# Altium schematic sheet DAC and MIC.SchDoc
size A; DocumentNumber: 8; SheetNumber: 8; SheetTotal: 11
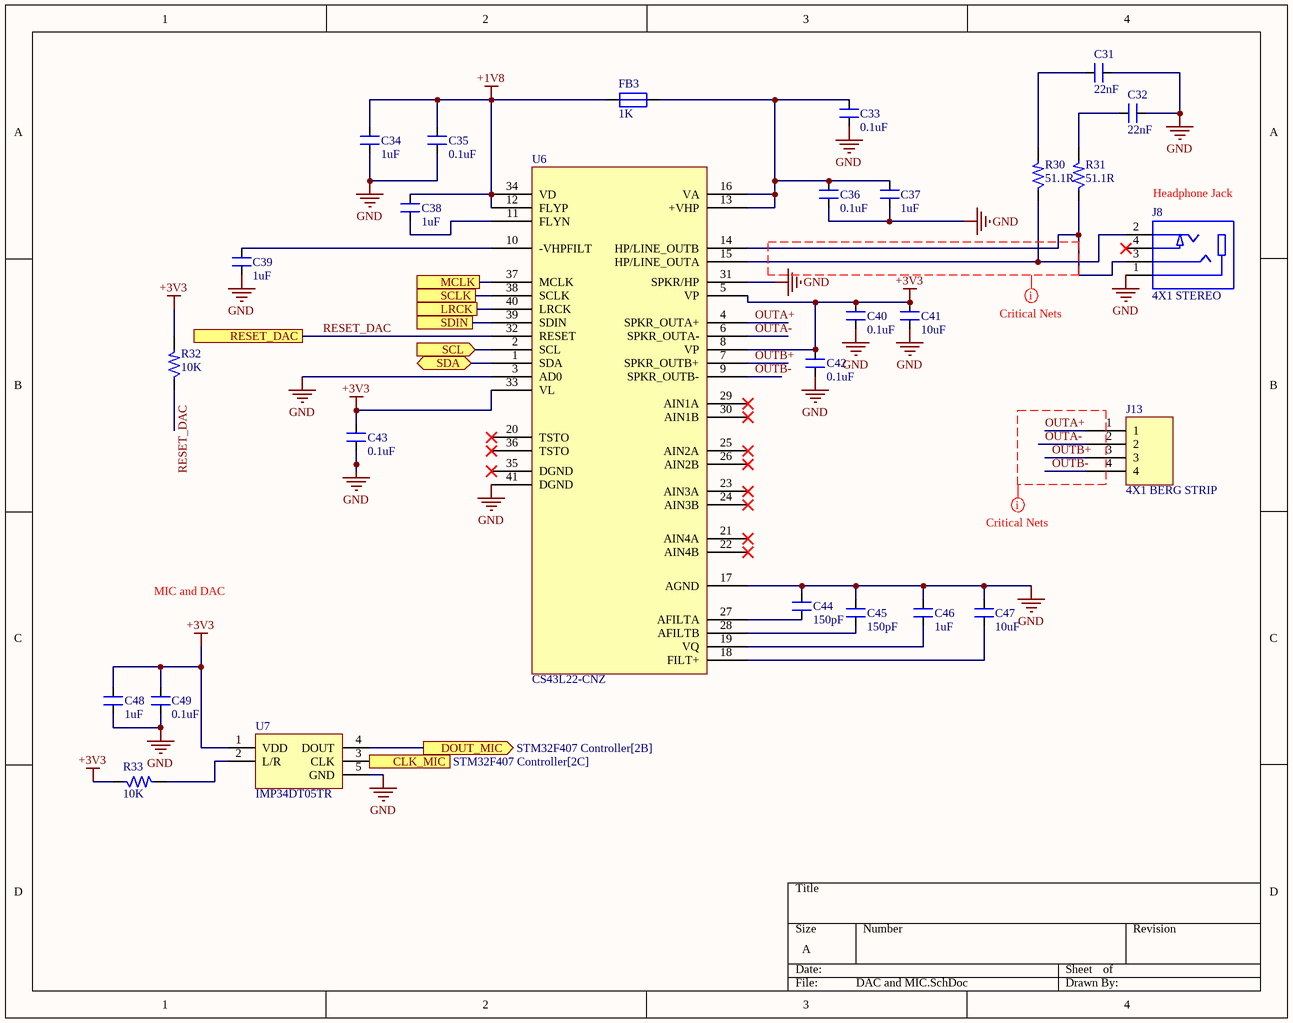
[diagram p0: DAC and MIC.SchDoc]

## Parts
C31  22nF  [CAP_0805]
C32  22nF  [CAP_0805]
C33  0.1uF  [CAP_0805]
C34  1uF  [CAP_0805]
C35  0.1uF  [CAP_0805]
C36  0.1uF  [CAP_0805]
C37  1uF  [CAP_0805]
C38  1uF  [CAP_0805]
C39  1uF  [CAP_0805]
C40  0.1uF  [CAP_0805]
C41  10uF  [CAP_1206]
C42  0.1uF  [CAP_0805]
C43  0.1uF  [CAP_0805]
C44  150pF  [CAP_0805]
C45  150pF  [CAP_0805]
C46  1uF  [CAP_0805]
C47  10uF  [CAP_1206]
C48  1uF  [CAP_0805]
C49  0.1uF  [CAP_0805]
FB3  1K  [IND_0805]
J8  4X1 STEREO  [CON_SJ-2504A-SMT-TR_SMD]
J13  4X1 BERG STRIP  [CON4_100_40D72_TH_ST_MALE]
R30  51.1R  [RES_0603]
R31  51.1R  [RES_0603]
R32  10K  [RES_0603]
R33  10K  [RES_0603]
U6  CS43L22-CNZ  [QFN40_19_284_33X9_SMD]
U7  IMP34DT05TR  [HCLGA-4_53_137_15X37_SMD]

## Ports
CLK_MIC (in, see STM32F407 Controller[2C]), DOUT_MIC (out, see STM32F407 Controller[2B]), LRCK (see STM32F407 Controller[2B]), MCLK (see STM32F407 Controller[2A]), RESET_DAC (see STM32F407 Controller[2B]), SCL (in, see ADC chip[3B], STM32F407 Controller[2B]), SCLK (see STM32F407 Controller[2B]), SDA (bidir, see ADC chip[3B], STM32F407 Controller[2B]), SDIN (see STM32F407 Controller[2C])

## Nets
+1V8: C34.2 C35.2 C38.2 FB3.1 U6.12(FLYP) U6.34(VD)
+3V3: C40.2 C41.2 C42.2 C43.2 C48.2 C49.2 R32.2 R33.1 U6.5(VP) U6.8(VP) U6.33(VL) U7.1(VDD)
GND: C31.2 C32.2 C33.1 C34.1 C35.1 C36.1 C37.1 C39.1 C40.1 C41.1 C42.1 C43.1 C44.2 C45.2 C46.2 C47.2 C48.1 C49.1 J8.1 U6.3(AD0) U6.17(AGND) U6.31(SPKR/HP) U6.41(DGND) U7.5(GND)
CLK_MIC: U7.3(CLK) ; port CLK_MIC
DOUT_MIC: U7.4(DOUT) ; port DOUT_MIC
LRCK: U6.40(LRCK) ; port LRCK
MCLK: U6.37(MCLK) ; port MCLK
OUTA+: J13.1 U6.4(SPKR_OUTA+)
OUTA-: J13.2 U6.6(SPKR_OUTA-)
OUTB+: J13.3 U6.7(SPKR_OUTB+)
OUTB-: J13.4 U6.9(SPKR_OUTB-)
RESET_DAC: R32.1 U6.32(RESET) ; port RESET_DAC
SCL: U6.2(SCL) ; port SCL
SCLK: U6.38(SCLK) ; port SCLK
SDA: U6.1(SDA) ; port SDA
SDIN: U6.39(SDIN) ; port SDIN
NetC31_1: C31.1 R30.2
NetC32_1: C32.1 R31.2
NetC33_2: C33.2 C36.2 C37.2 FB3.2 U6.13(+VHP) U6.16(VA)
NetC38_1: C38.1 U6.11(FLYN)
NetC39_2: C39.2 U6.10(-VHPFILT)
NetC44_1: C44.1 U6.27(AFILTA)
NetC45_1: C45.1 U6.28(AFILTB)
NetC46_1: C46.1 U6.19(VQ)
NetC47_1: C47.1 U6.18(FILT+)
NetJ8_2: J8.2 R30.1 U6.15(HP/LINE_OUTA)
NetJ8_3: J8.3 R31.1 U6.14(HP/LINE_OUTB)
NetR33_2: R33.2 U7.2(L/R)

Not connected (* = marked no-connect by the designer): J8 4*; U6 20(TSTO)* 21(AIN4A)* 22(AIN4B)* 23(AIN3A)* 24(AIN3B)* 25(AIN2A)* 26(AIN2B)* 29(AIN1A)* 30(AIN1B)* 35(DGND)* 36(TSTO)*

## Layout directives
net class Critical Nets: (no net found under the mark), OUTA+, OUTA-, OUTB+, OUTB-

## Notes on the sheet
- (near J8) Headphone Jack
- MIC and DAC

## Library data of the parts
C31 C32 = CAP_22nF-50V-10%-0805: 0.022µF ±10% 50V Ceramic Capacitor X7R 0805 (2012 Metric); Manufacturer: Samsung Electro-Mechanics; Manufacturer Part Number: CL21B223KBANNNC; Alternate Part Number-1: NA; Case/Package: 0805; Supplier-1: Digikey; Supplier Part Number-1: 1276-1081-1-ND - Cut Tape (CT)
C33 C35 C36 C40 C42 C43 C49 = CAP_0.1uF-50V-10%-0805: 0.1µF ±10% 50V Ceramic Capacitor X7R 0805 (2012 Metric); Manufacturer: Samsung; Manufacturer Part Number: CL21B104KBCNNNC; Alternate Part Number-1: NA; Case/Package: 0805; Supplier-1: SIRICOM; Supplier Part Number-1: 0805B104K500CT
C34 C37-C39 C46 C48 = CAP_1uF-50V-5%-0805: 1µF ±5% 50V Ceramic Capacitor X7R 0805 (2012 Metric); Manufacturer: Samsung; Manufacturer Part Number: CC0805JKX7R9BB105; Alternate Part Number-1: 0805F105M500NT; Case/Package: 0805; Supplier-1: SIRICOM; Supplier Part Number-1: CL21B105KBFNNNE
C41 C47 = CAP_10uF-50V-10%-1206: 10µF ±10% 50V Ceramic Capacitor X7R 1206 (3216 Metric); Manufacturer: KEMET; Manufacturer Part Number: CL31B106KBHNNNE; Alternate Part Number-1: GRT31CR61H106ME01L; Case/Package: 1206; Supplier-1: SIRICOM; Supplier Part Number-1: CC1206KKX5R9BB106
C44 C45 = CAP_150pF-50V-10%-0805: 150pF ±10% 50V Ceramic Capacitor C0G, NP0 0805 (2012 Metric); Manufacturer: AVX Corporation; Manufacturer Part Number: 08055A151KAT2A; Alternate Part Number-1: NA; Case/Package: 0805; Supplier-1: Digikey; Supplier Part Number-1: 478-10501-1-ND - Cut Tape (CT)
FB3 = FB_1K-100MHZ-1.6A-0805: 1 kOhms @ 100MHz 1 Power Line Ferrite Bead 0805 (2012 Metric) 1.6A; Manufacturer: Laird; Manufacturer Part Number: BLM21SP102SH1D; Alternate Part Number-1: NA; Case/Package: 0805; Supplier-1: SIRICOM; Supplier Part Number-1: ACMS201209A102
J8 = CON-PLG-STEREO_4X1-100-RA-SMD: 2.50mm (0.094", 3/32", Sub Mini, Miniature) - Headphone Phone Jack Stereo (4 Conductor, TRRS) Connector Solder; Manufacturer: CUI Devices; Manufacturer Part Number: SJ-2504A-SMT-TR; Alternate Part Number-1: NA; Case/Package: SMD; Supplier Part Number-1: CP-SJ-2504A-SMT-CT-ND - Cut Tape (CT); Supplier-1: Digikey
J13 = CON-BS-PLG_4X1-100-ST-TH: 4 Pins, 1 Row 2.54mm Pitch, Straight bergstrip, Male; Manufacturer: NA; Manufacturer Part Number: NA; Case/Package: TH-CON; Supplier-1: SP ROAD; Supplier Part Number-1: NA; Alternate Part Number-1: NA
R30 R31 = RES_51.1R-0.1W-1%-0603: 51.1 Ohms ±1% 0.1W, 1/10W Chip Resistor 0603 (1608 Metric) Thick Film; Manufacturer: Vishay Dale; Manufacturer Part Number: CRCW060351R1FKEAC; Alternate Part Number-1: NA; Case/Package: 0603; Supplier-1: Digikey; Supplier Part Number-1: 541-5468-1-ND - Cut Tape (CT)
R32 R33 = RES_10K-0.1W-1%-0603: 10 kOhms ±1% 0.1W, 1/10W Chip Resistor 0603 (1608 Metric) Automotive AEC-Q200 Thick Film; Manufacturer: Walsin; Manufacturer Part Number: WR06X1002FTL; Alternate Part Number-1: 0603WAJ0103T5E; Case/Package: 0603; Supplier-1: SIRICOM; Supplier Part Number-1: WR06X1002FTL
U6 = IC_CS43L22: Audio D/A Converter ICs Low Power Stereo DAC w/ClassD Spkr Driver; Manufacturer: Cirrus Logic; Alternate Part Number-1: NA; Manufacturer Part Number: CS43L22-CNZ; Case/Package: QFN-40; Supplier-1: Mouser; Supplier Part Number-1: 777-CS43L22-CNZ
U7 = IC_IMP34DT05TR: MEMS Microphones AUTO & INDUSTRIAL SENSORS; Manufacturer: STMicroelectronics; Alternate Part Number-1: NA; Manufacturer Part Number: IMP34DT05TR; Case/Package: HCLGA-4; Supplier-1: Mouser; Supplier Part Number-1: 511-IMP34DT05TR